# EAGLE design pot_board_2 (EAGLE 7.6.0)
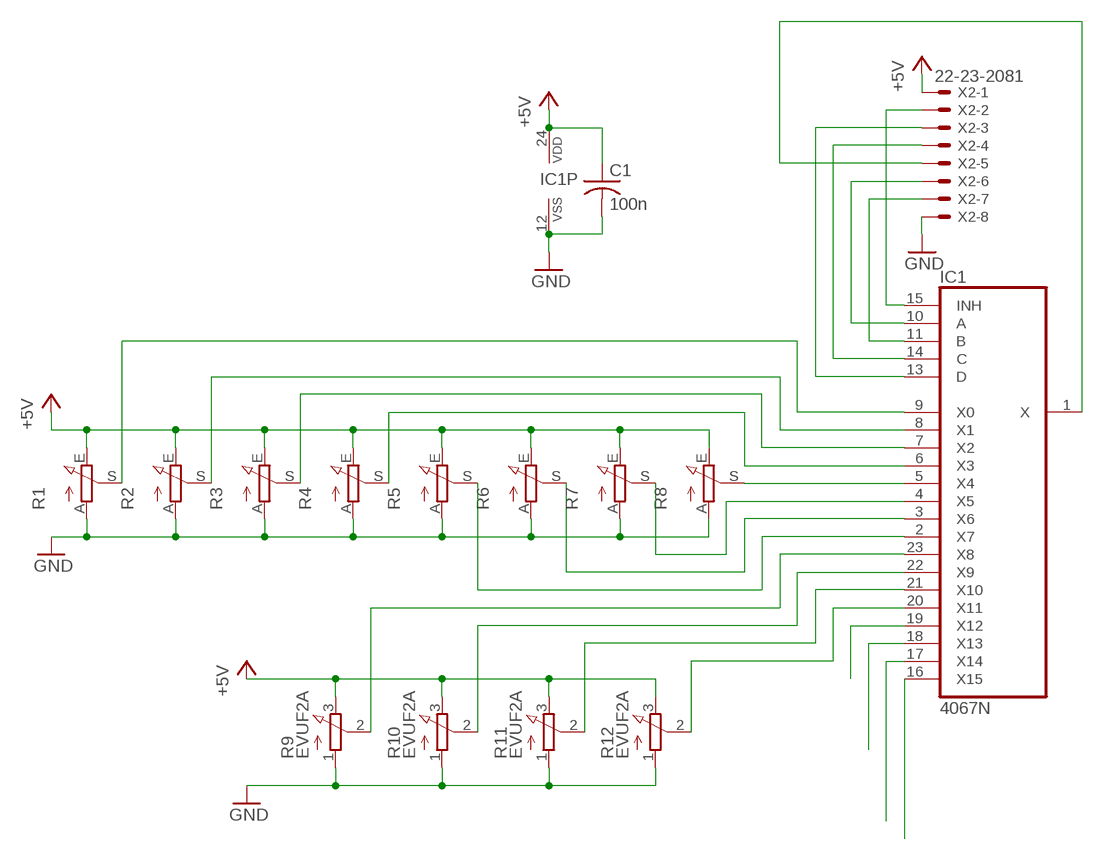
[diagram p0: schematic, sheet 1]

## Parts
C1  100n  C-US025-024X044  [C025-024X044]
IC1  4067N  [DIL24-6]
R1  3RP/1610N45MM-SLIDE  [ST15]
R2  3RP/1610N45MM-SLIDE  [ST15]
R3  3RP/1610N45MM-SLIDE  [ST15]
R4  3RP/1610N45MM-SLIDE  [ST15]
R5  3RP/1610N45MM-SLIDE  [ST15]
R6  3RP/1610N45MM-SLIDE  [ST15]
R7  3RP/1610N45MM-SLIDE  [ST15]
R8  3RP/1610N45MM-SLIDE  [ST15]
R9  EVUF2A  [EVUF]
R10  EVUF2A  [EVUF]
R11  EVUF2A  [EVUF]
R12  EVUF2A  [EVUF]
X2  22-23-2081  [22-23-2081]

## Nets
+5V: C1.1 IC1.24(VDD) R1.E R2.E R3.E R4.E R5.E R6.E R7.E R8.E R9.3(E) R10.3(E) R11.3(E) R12.3(E) X2.1
GND: C1.2 IC1.12(VSS) R1.A R2.A R3.A R4.A R5.A R6.A R7.A R8.A R9.1(A) R10.1(A) R11.1(A) R12.1(A) X2.8
N$1: IC1.9(X0) R1.S
N$2: IC1.8(X1) R2.S
N$3: IC1.7(X2) R3.S
N$4: IC1.6(X3) R4.S
N$5: IC1.5(X4) R8.S
N$6: IC1.4(X5) R7.S
N$7: IC1.3(X6) R6.S
N$8: IC1.2(X7) R5.S
N$9: IC1.15(INH) X2.2
N$11: IC1.23(X8) R9.2(S)
N$12: IC1.11(B) X2.7
N$13: IC1.10(A) X2.6
N$14: IC1.14(C) X2.4
N$15: IC1.13(D) X2.3
N$17: IC1.1(X) X2.5
N$18: IC1.22(X9) R10.2(S)
N$19: IC1.21(X10) R11.2(S)
N$20: IC1.20(X11) R12.2(S)
N$21: IC1.19(X12)
N$22: IC1.18(X13)
N$23: IC1.17(X14)
N$24: IC1.16(X15)

## Library data of the parts
C1 = rcl:C-US: CAPACITOR, American symbol
IC1 = 40xx:4067: 16-channel ANALOG MULTIPLEXER
R1-R8 = pot:3RP/1610N: 16mm Potentiometer one level Source: http://www.alphapotentiometers.net/html/16mm_pot_2.html
R9-R12 = pot:EVU: 9 mm Square Rotary Potentiometers Source: Panasonic
X2 = con-molex:22-23-2081: .100" (2.54mm) Center Header - 8 Pin; MF: MOLEX; MPN: 22-23-2081; OC_FARNELL: 1756826; OC_NEWARK: 01C7592

## Board
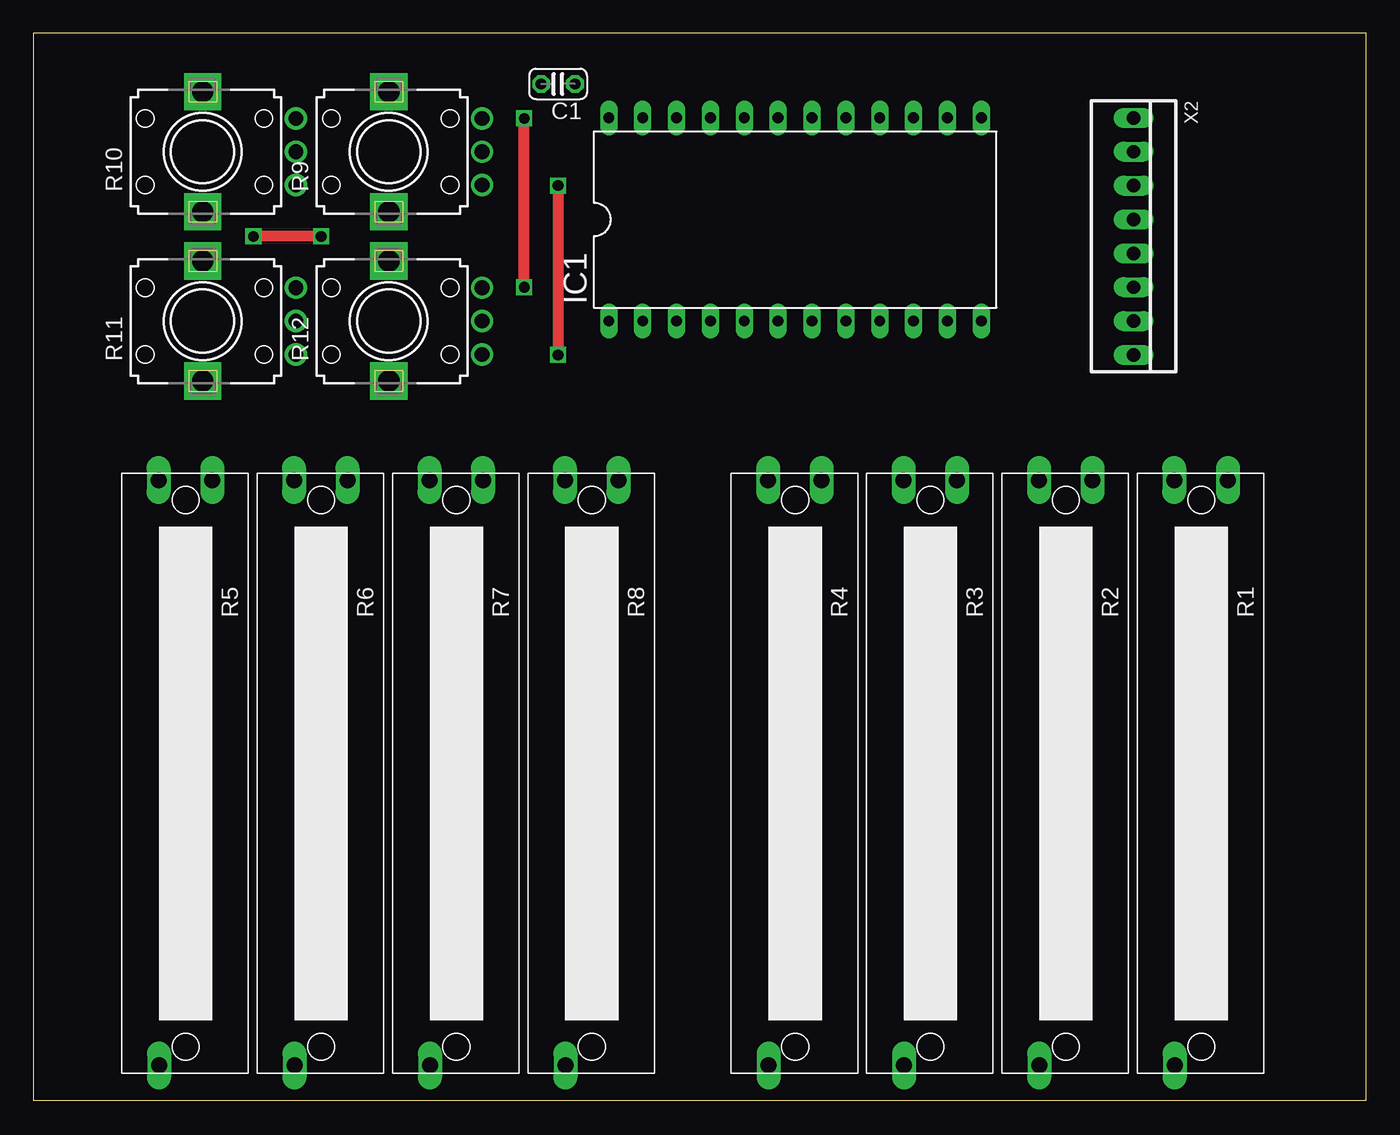
[diagram p1: board, top side]
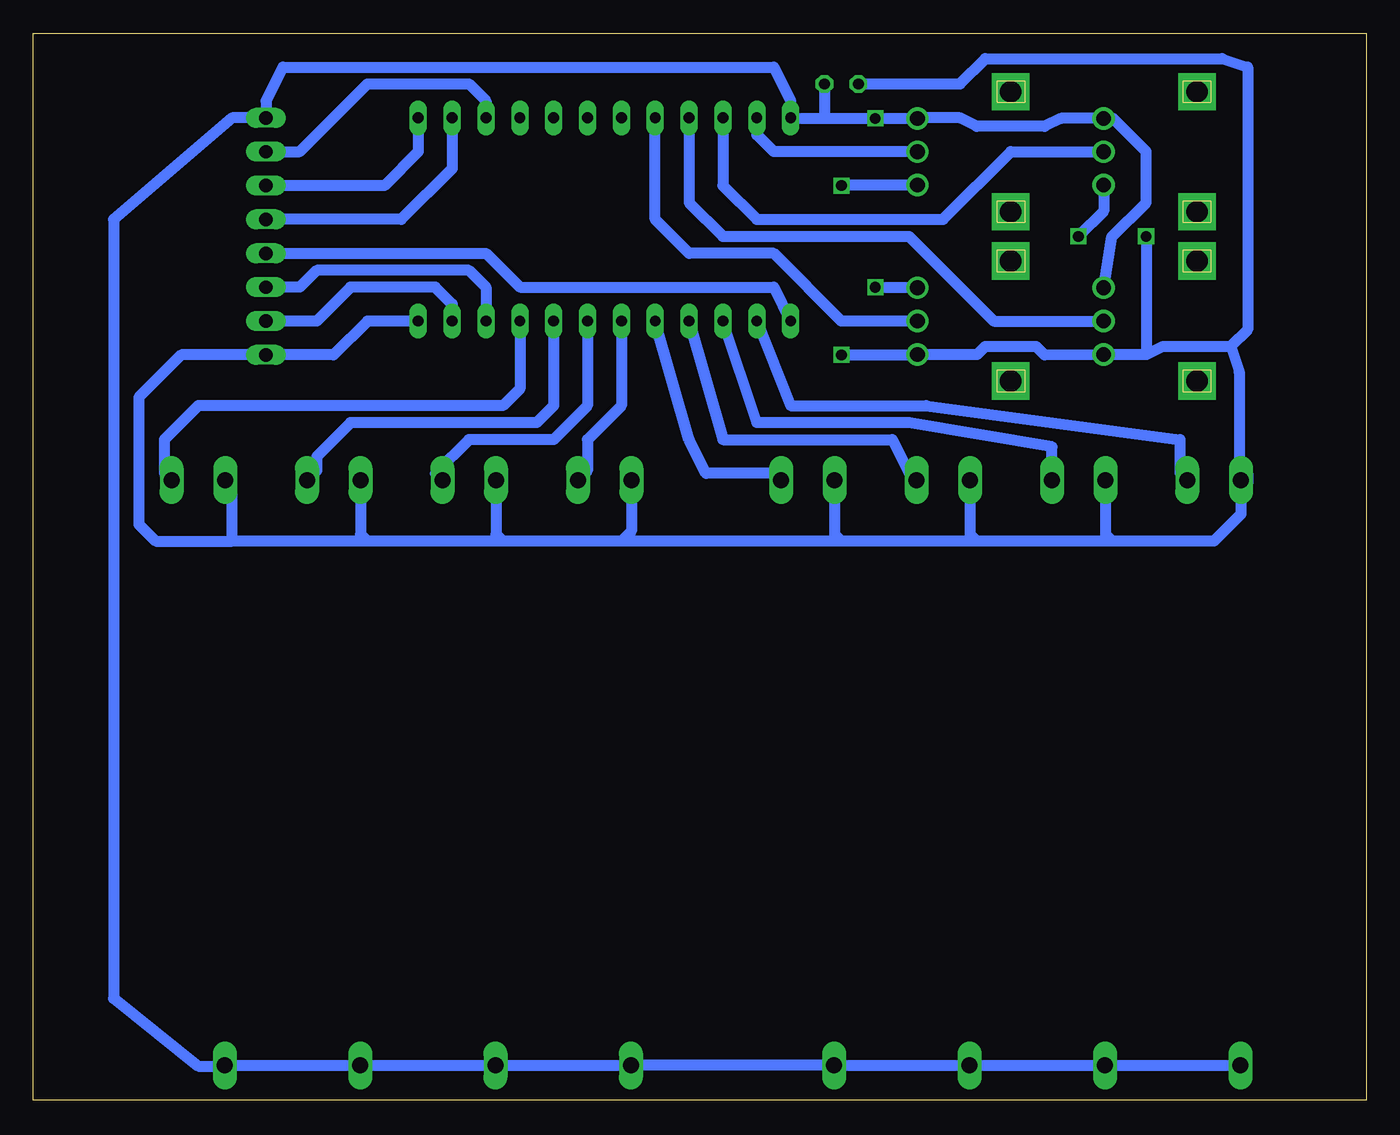
[diagram p2: board, bottom side, seen from below]

Size 100 x 80 mm. Coordinates in mm from the lower left corner, seen from the top.
Outline: 0,0 100,0 100,80 0,80 0,0
Copper layers (1*16): Top 0.035mm / dielectric 1.5mm / Bottom 0.035mm
Design rules "default *": minimum track width 32mil, minimum drill 31mil, track to track 18mil, track to pad 18mil, pad to pad 18mil, via to via 18mil, smd to smd 8mil, copper to edge 0mil, drill to drill 18mil, minimum pad ring 10mil, minimum via ring 8mil, stop-mask expansion 4mil, vias tented up to drill 0mil, thermal gap 10mil

### Footprints (pad centres in the part's own frame; a part is rotated, then mirrored left to right if it is on the bottom)
C025-024X044 = drill 0.813 octagon: 1 -1.27,0; 2 1.27,0
DIL24-6 = drill 0.813 long: 1 -13.97,-7.62; 2 -11.43,-7.62; 3 -8.89,-7.62; 4 -6.35,-7.62; 5 -3.81,-7.62; 6 -1.27,-7.62; 7 1.27,-7.62; 8 3.81,-7.62; 9 6.35,-7.62; 10 8.89,-7.62; 11 11.43,-7.62; 12 13.97,-7.62; 13 13.97,7.62; 14 11.43,7.62; 15 8.89,7.62; 16 6.35,7.62; 17 3.81,7.62; 18 1.27,7.62; 19 -1.27,7.62; 20 -3.81,7.62; 21 -6.35,7.62; 22 -8.89,7.62; 23 -11.43,7.62; 24 -13.97,7.62
ST15 = drill 1.2 long: A 2.025,0.505; E 1.99,44.4; S -1.99,0.5
EVUF = drill 1.1 pad 1.676: 1 -2.5,-7; 2 0,-7; 3 2.5,-7 | drill 1.6 pad 2.8 square: M1 4.5,0; M2 -4.5,0
22-23-2081 = drill 1 long: 1 -8.89,0; 2 -6.35,0; 3 -3.81,0; 4 -1.27,0; 5 1.27,0; 6 3.81,0; 7 6.35,0; 8 8.89,0

### Placement (x,y rotation side)
C1  39.37,76.2 180 top
IC1  57.15,66.04 0 top
R1  87.63,46.99 180 top
R2  77.47,46.99 180 top
R3  67.31,46.99 180 top
R4  57.15,46.99 180 top
R5  11.43,46.99 180 top
R6  21.59,46.99 180 top
R7  31.75,46.99 180 top
R8  41.91,46.99 180 top
R9  26.67,71.12 90 top
R10  12.7,71.12 90 top
R11  12.7,58.42 90 top
R12  26.67,58.42 90 top
X2  82.55,64.77 270 top

### Tracks (layer width: path | path; a pad name or v marks a point on that pad's centre or on a via)
+5V  (via drill 0.8)
  Top 0.813: v36.83,60.96 v36.83,73.62
  Bottom 0.813: R5.E R6.E R7.E R8.E R4.E R3.E R2.E R1.E 85.69,2.54 87.63,2.54 93.98,7.62 93.98,66.04 85.09,73.66 X2.1 82.55,74.93 81.28,77.47 44.45,77.47 43.18,74.93 IC1.24 43.14,73.62 40.64,73.62 | 40.64,73.62 v36.83,73.62 R9.3 33.63,73.66 30.48,73.66 29.21,73.03 24.13,73.03 22.9,73.62 R10.3 19.66,73.66 19.05,73.66 16.51,71.12 16.51,67.31 19.09,64.73 R11.3 | R12.3 36.79,60.92 v36.83,60.96 | C1.1 40.64,73.62
GND  (via drill 0.8)
  Top 0.813: v21.59,64.77 v16.51,64.77 | v39.37,68.58 v39.37,55.88
  Bottom 0.813: IC1.12 74.93,58.42 77.47,55.88 X2.8 88.9,55.88 92.08,52.7 92.08,43.18 90.81,41.91 85.09,41.91 | 9.4,45.72 R5.A 8.89,47 | 9.4,45.72 9.4,43.94 11.43,41.91 19.05,41.91 | 19.05,41.91 29.21,41.91 | 29.21,41.91 39.37,41.91 | 39.37,41.91 55.88,41.91 | 55.88,41.91 64.77,41.91 | 64.77,41.91 74.93,41.91 | 74.93,41.91 85.09,41.91 | 85.09,41.91 85.09,45.73 R1.A | R2.A 75.44,42.42 74.93,41.91 | R4.A 55.12,42.66 55.88,41.91 | R3.A 65.28,42.42 64.77,41.91 | R8.A 39.88,42.42 39.37,41.91 | R7.A 29.73,42.42 29.21,41.91 | R6.A 19.57,42.42 19.05,41.91 | 9.4,45.72 8.89,46.23 8.89,46.99 9.53,46.99 9.53,54.61 10.16,56.52 | 16.51,55.92 R11.1 24.13,55.88 24.77,56.52 28.57,56.52 29.17,55.92 R12.1 33.71,55.88 v39.37,55.88 | 16.51,55.92 16.47,55.92 15.24,56.52 10.16,56.52 | R10.1 19.7,66.66 v21.59,64.77 | v16.51,64.77 16.51,55.92 | R9.1 39.33,68.62 v39.37,68.58 | C1.2 30.48,76.2 28.57,78.11 10.79,78.11 8.89,77.47 8.89,57.78 10.16,56.52
N$1
  Bottom 0.813: IC1.9 63.5,53.34 64.77,52.07 87.63,52.07 90.17,49.53 90.17,47.04 R1.S
N$2
  Bottom 0.813: IC1.8 60.96,52.07 62.23,50.8 76.2,50.8 78.74,48.26 78.74,47.21 R2.S
N$3
  Bottom 0.813: IC1.7 58.42,52.07 60.96,49.53 67.31,49.53 69.85,46.99 69.8,46.99 R3.S
N$4
  Bottom 0.813: IC1.6 55.88,52.07 58.42,49.53 58.42,47.21 R4.S
N$5
  Bottom 0.813: R8.S 43.9,47.71 44.45,46.99 49.53,46.99 50.8,49.53 IC1.5
N$6
  Bottom 0.813: IC1.4 48.26,49.53 35.56,49.53 34.29,47.04 R7.S
N$7
  Bottom 0.813: R6.S 23.58,48.98 34.29,50.8 45.72,50.8 IC1.3
N$8
  Bottom 0.813: IC1.2 43.18,52.07 33.02,52.07 13.97,49.53 13.97,47.04 R5.S
N$9
  Bottom 0.813: X2.2 80.01,71.12 74.93,76.2 67.31,76.2 66.04,74.93 IC1.15
N$11
  Bottom 0.813: IC1.23 45.72,72.39 44.45,71.12 R9.2
N$12
  Bottom 0.813: IC1.11 68.58,59.69 69.85,60.96 76.2,60.96 78.74,58.42 X2.7
N$13
  Bottom 0.813: X2.6 80.01,60.96 78.74,62.23 67.31,62.23 66.04,60.96 IC1.10
N$14
  Bottom 0.813: IC1.14 68.58,69.85 72.39,66.04 X2.4
N$15
  Bottom 0.813: IC1.13 71.12,71.12 73.66,68.58 X2.3
N$17
  Bottom 0.813: X2.5 66.04,63.5 63.5,60.96 44.45,60.96 IC1.1
N$18
  Bottom 0.813: IC1.22 48.26,68.58 45.72,66.04 31.75,66.04 26.67,71.12 R10.2
N$19
  Bottom 0.813: IC1.21 50.8,67.31 48.26,64.77 34.29,64.77 27.94,58.42 R11.2
N$20
  Bottom 0.813: IC1.20 53.34,66.04 50.8,63.5 44.45,63.5 39.37,58.42 R12.2